# Altium project Shut_Down_Circuit.PrjPcb
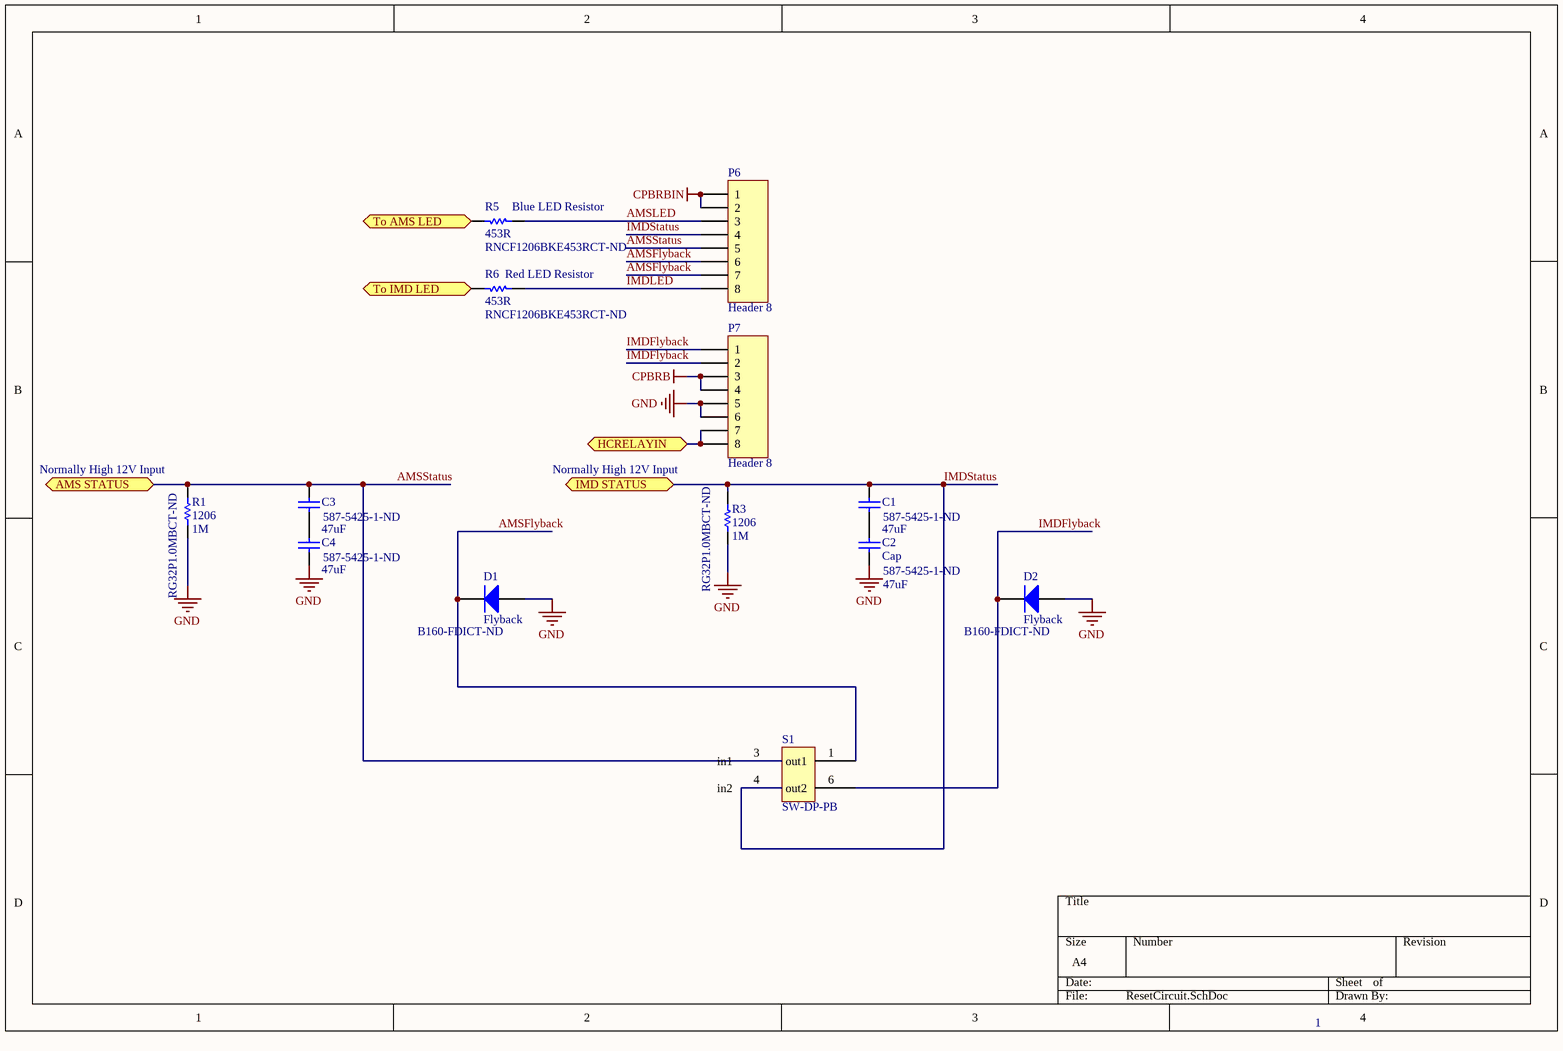
[diagram p0: ResetCircuit.SchDoc]
1 sheet, 13 parts. Net scope: flat (ports and power ports of the same name join across sheets).

## Sheet ResetCircuit.SchDoc
size A4; Date: 2017-12-21; DrawnBy: Tylynn Haddow; Revision: 2; DocumentName: Reset Circuit

### Parts
C1  value 47uF  Supplier Part Number 1: 587-5425-1-ND  [C1206]  (hidden comment: Cap)
C2  Cap  value 47uF  Supplier Part Number 1: 587-5425-1-ND  [C1206]
C3  value 47uF  Supplier Part Number 1: 587-5425-1-ND  [C1206]  (hidden comment: Cap)
C4  value 47uF  Supplier Part Number 1: 587-5425-1-ND  [C1206]  (hidden comment: Cap)
D1  Flyback  Supplier Part Number 1: B160-FDICT-ND  [DO-214AC, SMA]
D2  Flyback  Supplier Part Number 1: B160-FDICT-ND  [DO-214AC, SMA]
P6  Header 8  [HDR1X8]
P7  Header 8  [HDR1X8]
R1  1206  value 1M  Supplier Part Number 1: RG32P1.0MBCT-ND  [1206 (High Density)]
R3  1206  value 1M  Supplier Part Number 1: RG32P1.0MBCT-ND  [1206 (High Density)]
R5  Blue LED Resistor  value 453R  Supplier Part Number 1: RNCF1206BKE453RCT-ND  [C1206]
R6  Red LED Resistor  value 453R  Supplier Part Number 1: RNCF1206BKE453RCT-ND  [C1206]
S1  SW-DP-PB  [SW-DP-PB]

### Ports
AMS STATUS (bidir), HCRELAYIN (bidir), IMD STATUS (bidir), To AMS LED (bidir), To IMD LED (bidir)

### Nets
CPBRB: P7.3 P7.4
CPBRBIN: P6.1 P6.2
GND: C2.1 C4.1 D1.1(A) D2.1(A) P7.5 P7.6 R1.1 R3.1
AMSFlyback: D1.2(K) P6.6 P6.7 S1.1(out1)
AMSLED: P6.3 R5.2
AMSStatus: C3.2 P6.5 R1.2 S1.3(in1) ; port AMS STATUS
IMDFlyback: D2.2(K) P7.1 P7.2 S1.6(out2)
IMDLED: P6.8 R6.2
IMDStatus: C1.2 P6.4 R3.2 S1.4(in2) ; port IMD STATUS
NetC1_1: C1.1 C2.2
NetC3_1: C3.1 C4.2
NetP7_7: P7.7 P7.8 ; port HCRELAYIN
NetR5_1: R5.1 ; port To AMS LED
NetR6_1: R6.1 ; port To IMD LED

### Notes on the sheet
- (near R1) Normally High 12V Input
- Normally High 12V Input
- 1

### Library data of the parts
C1-C4 = Cap: Capacitor; Published: 8-Jun-2000; LatestRevisionDate: 17-Jul-2002; LatestRevisionNote: Re-released for DXP Platform.; PackageReference: RAD-0.3; Publisher: Altium Limited; PackageDescription: Radial Cap, Thru-Hole; 2 Leads; 0.3 in Pin Spacing
  C3 C4: Supplier 1: Digikey
D1 D2 = Diode: Default Diode; Published: 8-Jun-2000; LatestRevisionDate: 17-Jul-2002; LatestRevisionNote: Re-released for DXP Platform.; PackageVersion: Sep-1996; PackageReference: SMC; Publisher: Altium Limited; PackageDescription: DO-214-AB/SMC; 2 C-Bend Leads; Body 7.9 x 5.9 mm, inc. leads (LxW); Code_JEDEC: DO-214-AB; Supplier 1: Digi-Key
P6 = Header 8: Header, 8-Pin, A98338-ND; LatestRevisionDate: 17-Jul-2002; LatestRevisionNote: Re-released for DXP Platform.; Publisher: Altium Limited; Supplier Part Number 1: A98338-ND; Supplier 1: Digikey
P7 = Header 8: Header, 8-Pin A98338-ND; LatestRevisionDate: 17-Jul-2002; LatestRevisionNote: Re-released for DXP Platform.; Publisher: Altium Limited; Supplier Part Number 1: A98338-ND; Supplier 1: Digikey
R1 R3 R5 R6 = Res1: Resistor; Published: 8-Jun-2000; LatestRevisionDate: 17-Jul-2002; LatestRevisionNote: Re-released for DXP Platform.; PackageReference: AXIAL-0.3; Publisher: Altium Limited; PackageDescription: Axial Device, Thru-Hole; 2 Leads; 0.3 in Pin Spacing; Supplier 1: Digi-Key
S1 = SW-DP-PB: Supplier Part Number 1: CKN9865-ND; Supplier 1: Digikey